# EAGLE design nerd100 (EAGLE 4.16)
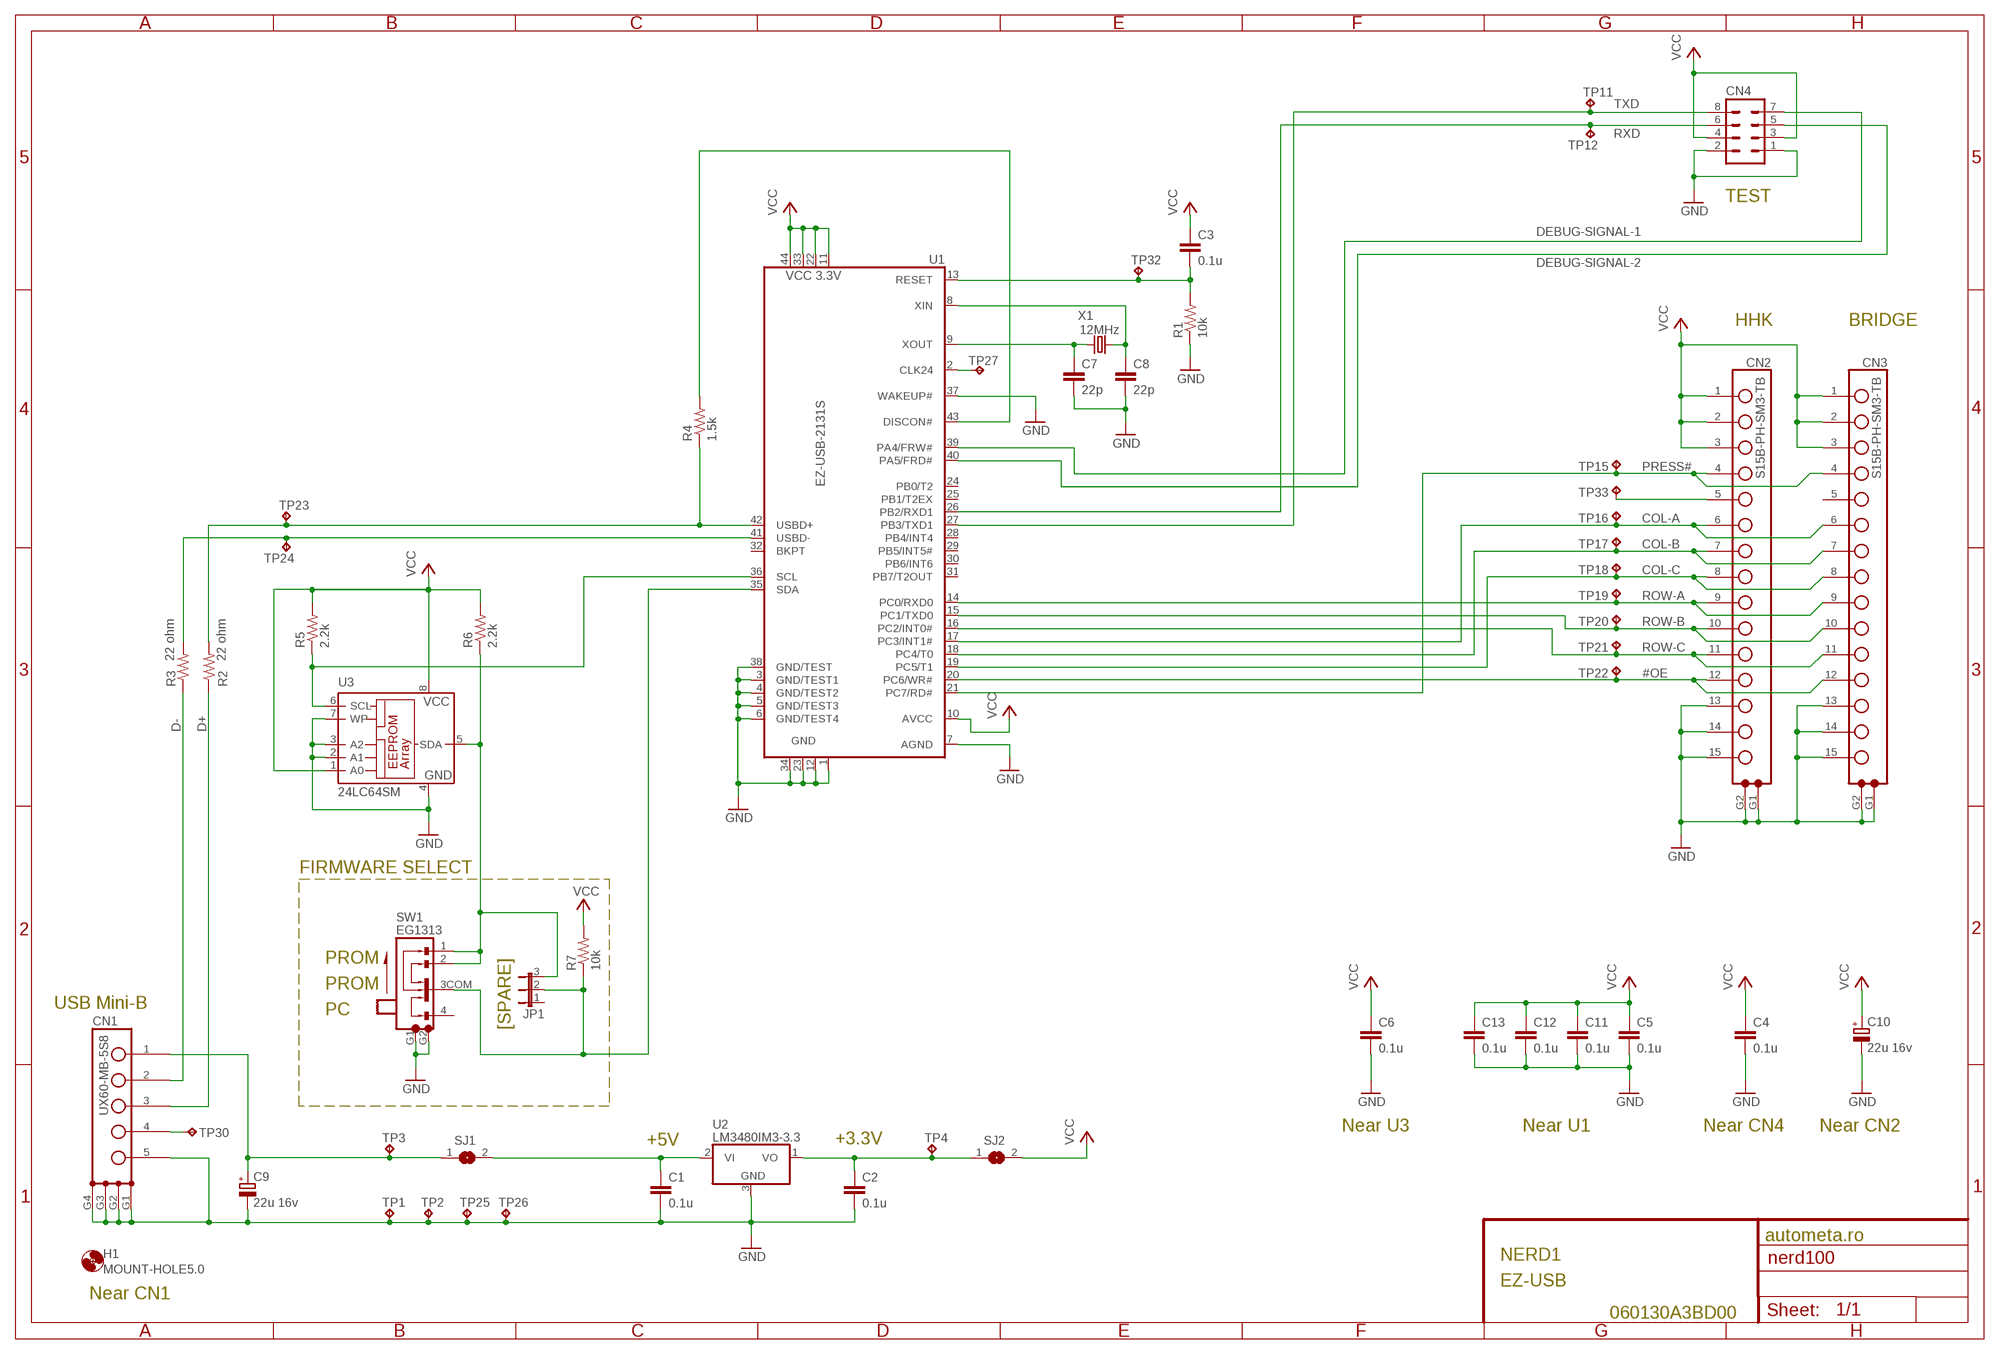
[diagram p0: schematic, sheet 1]

## Parts
C1  0.1u  C-EUC0805  [C0805]
C2  0.1u  C-EUC0805  [C0805]
C3  0.1u  C-EUC0805  [C0805]
C4  0.1u  C-EUC0805  [C0805]
C5  0.1u  C-EUC0805  [C0805]
C6  0.1u  C-EUC0805  [C0805]
C7  22p  C-EUC0805  [C0805]
C8  22p  C-EUC0805  [C0805]
C9  22u 16v  CPOL-EUC  [PANASONIC_C]
C10  22u 16v  CPOL-EUC  [PANASONIC_C]
C11  0.1u  C-EUC0805  [C0805]
C12  0.1u  C-EUC0805  [C0805]
C13  0.1u  C-EUC0805  [C0805]
CN1  UX60-MB-5S8  UX60-MB-5S8UX60-MB-5S8  [UX60-MB-5S8]
CN2  S15B-PH-SM3-TB  S15B-PH-SM-TBS15B-PH-SM3-TB  [S15B-PH-SM*-TB]
CN3  S15B-PH-SM3-TB  S15B-PH-SM-TBS15B-PH-SM3-TB  [S15B-PH-SM*-TB]
CN4  MA04-2  [MA04-2]
H1  MOUNT-HOLE5.0  [5,0]
JP1  JP2E  [JP2]
R1  10k  R-US_R0805  [R0805]
R2  22 ohm  R-US_R0805  [R0805]
R3  22 ohm  R-US_R0805  [R0805]
R4  1.5k  R-US_R0805  [R0805]
R5  2.2k  R-US_R0805  [R0805]
R6  2.2k  R-US_R0805  [R0805]
R7  10k  R-US_R0805  [R0805]
SJ1  SJW  [SJW]
SJ2  SJW  [SJW]
SW1  EG1313  [EG1313]
TP1  TPPAD1-13  [P1-13]
TP2  TPPAD1-13  [P1-13]
TP3  TPPAD1-13  [P1-13]
TP4  TPPAD1-13  [P1-13]
TP11  TPPAD1-13  [P1-13]
TP12  TPPAD1-13  [P1-13]
TP15  TPPAD1-13  [P1-13]
TP16  TPPAD1-13  [P1-13]
TP17  TPPAD1-13  [P1-13]
TP18  TPPAD1-13  [P1-13]
TP19  TPPAD1-13  [P1-13]
TP20  TPPAD1-13  [P1-13]
TP21  TPPAD1-13  [P1-13]
TP22  TPPAD1-13  [P1-13]
TP23  TPPAD1-13  [P1-13]
TP24  TPPAD1-13  [P1-13]
TP25  TPPAD1-13  [P1-13]
TP26  TPPAD1-13  [P1-13]
TP27  TPPAD1-13  [P1-13]
TP30  TPPAD1-13  [P1-13]
TP32  TPPAD1-13  [P1-13]
TP33  TPPAD1-13  [P1-13]
U1  EZ-USB-2131S  [PQFP44]
U2  LM3480IM3-3.3  LM3840  [SOT-23]
U3  24LC64SM  [SO-08M]
X1  12MHz  CRYTALHC49U-V  [HC49U-V]

## Nets
#OE: CN2.12($12) CN3.12($12) TP22.1(TP) U1.20(PC6/WR#)
COL-A: CN2.6($6) CN3.6($6) TP16.1(TP) U1.17(PC3/INT1#)
COL-B: CN2.7($7) CN3.7($7) TP17.1(TP) U1.18(PC4/T0)
COL-C: CN2.8($8) CN3.8($8) TP18.1(TP) U1.19(PC5/T1)
D+: CN1.3(D+) R2.1
D-: CN1.2(D-) R3.1
DEBUG-SIGNAL-1: CN4.7 U1.39(PA4/FRW#)
DEBUG-SIGNAL-2: CN4.5 U1.40(PA5/FRD#)
GND [GND]: C1.2 C2.2 C4.2 C5.2 C6.2 C7.2 C8.2 C9.- C10.- C11.2 C12.2 C13.2 CN1.5(GND) CN1.G1 CN1.G2 CN1.G3 CN1.G4 CN2.13($13) CN2.14($14) CN2.15($15) CN2.G1 CN2.G2 CN3.13($13) CN3.14($14) CN3.15($15) CN3.G1 CN3.G2 CN4.1 CN4.2 R1.1 SW1.G1 SW1.G2 TP1.1(TP) TP2.1(TP) TP25.1(TP) TP26.1(TP) U1.1(GND) U1.3(GND/TEST1) U1.4(GND/TEST2) U1.5(GND/TEST3) U1.6(GND/TEST4) U1.7(AGND) U1.12(GND) U1.23(GND) U1.34(GND) U1.37(WAKEUP#) U1.38(GND/TEST) U2.3(GND) U3.2(A1) U3.3(A2) U3.4(GND) U3.7(WP)
N$1: C7.1 U1.9(XOUT) X1.1
N$2: R3.2 TP24.1(TP) U1.41(USBD-)
N$3: C8.1 U1.8(XIN) X1.2
N$4: C3.2 R1.2 TP32.1(TP) U1.13(RESET)
N$5: R2.2 R4.1 TP23.1(TP) U1.42(USBD+)
N$6 [+V]: C1.1 SJ1.2 U2.2(VI)
N$7: R4.2 U1.43(DISCON#)
N$16 [+V]: C2.1 SJ2.1 TP4.1(TP) U2.1(VO)
N$17: TP27.1(TP) U1.2(CLK24)
N$18: CN1.4(ID) TP30.1(TP)
N$20: JP1.3 R6.1 SW1.1 SW1.2 U3.5(SDA)
N$26: CN2.5($5) TP33.1(TP)
PRESS#: CN2.4($4) CN3.4($4) TP15.1(TP) U1.21(PC7/RD#)
ROW-A: CN2.9($9) CN3.9($9) TP19.1(TP) U1.14(PC0/RXD0)
ROW-B: CN2.10($10) CN3.10($10) TP20.1(TP) U1.15(PC1/TXD0)
ROW-C: CN2.11($11) CN3.11($11) TP21.1(TP) U1.16(PC2/INT0#)
RXD: CN4.6 TP12.1(TP) U1.26(PB2/RXD1)
SCL: R5.1 U1.36(SCL) U3.6(SCL)
SDA: JP1.2 R7.1 SW1.3COM U1.35(SDA)
TXD: CN4.8 TP11.1(TP) U1.27(PB3/TXD1)
VBUS [+V]: C9.+ CN1.1(VBUS) SJ1.1 TP3.1(TP)
VCC [+V]: C3.1 C4.1 C5.1 C6.1 C10.+ C11.1 C12.1 C13.1 CN2.1($1) CN2.2($2) CN2.3($3) CN3.1($1) CN3.2($2) CN3.3($3) CN4.3 CN4.4 R5.2 R6.2 R7.2 SJ2.2 U1.10(AVCC) U1.11(VCC3.3) U1.22(VCC3.3) U1.33(VCC3.3) U1.44(VCC3.3) U3.1(A0) U3.8(VCC)
Unconnected: CN3.5($5) JP1.1 SW1.4 U1.24(PB0/T2) U1.25(PB1/T2EX) U1.28(PB4/INT4) U1.29(PB5/INT5#) U1.30(PB6/INT6) U1.31(PB7/T2OUT) U1.32(BKPT)

## Notes on the sheet
- TEST
- HHK | BRIDGE
- FIRMWARE SELECT
- PROM
- PROM
- USB Mini-B
- PC
- [SPARE]
- Near U3 | Near U1 | Near CN4 | Near CN2
- +5V | +3.3V
- autometa.ro
- NERD1
- Near CN1 | EZ-USB
- 060130A3BD00

## Library data of the parts
C1-C8 C11-C13 = rcl:C-EU: CAPACITOR, European symbol
C9 C10 = rcl:CPOL-EU: POLARIZED CAPACITOR, European symbol
CN1 = nerd100:UX60-MB-5S8: USB mini-B receptor
CN2 CN3 = nerd100:S15B-PH-SM*-TB: connecter header vender: JST pin pitch: 2.0mm pins: 15 angle: right angle mount: SMD
CN4 = con-lstb:MA04-2: PIN HEADER
H1 = holes:MOUNT-HOLE: MOUNTING HOLE with drill center marker
JP1 = jumper:JP2E: JUMPER
R1-R7 = rcl:R-US_: RESISTOR, American symbol
SJ1 SJ2 = jumper:SJ: SMD solder JUMPER
SW1 = nerd100:EG1313: EG1313: SLIDE SWITCH VENDOR: E-SWITCH PIN: 4 LEAD: THROUGH HOLE CIRCUIT: 1 CONTACT: 3 + 1COMMON
TP1-TP4 TP11 TP12 TP15-TP27 TP30 TP32 TP33 = testpad:TP
U1 = cypress:EZ-USB-2*S: Microcontroller with USB port
U2 = nerd100:LM3840: 3 terminal regurator
U3 = microchip:24*: Serial EEPROM I2C
X1 = crystal:CRYTAL: CRYSTAL

## Net classes
1 GND: width 0.254 mm, drill 0.254 mm
2 +V: width 0.254 mm, drill 0.254 mm

## Board
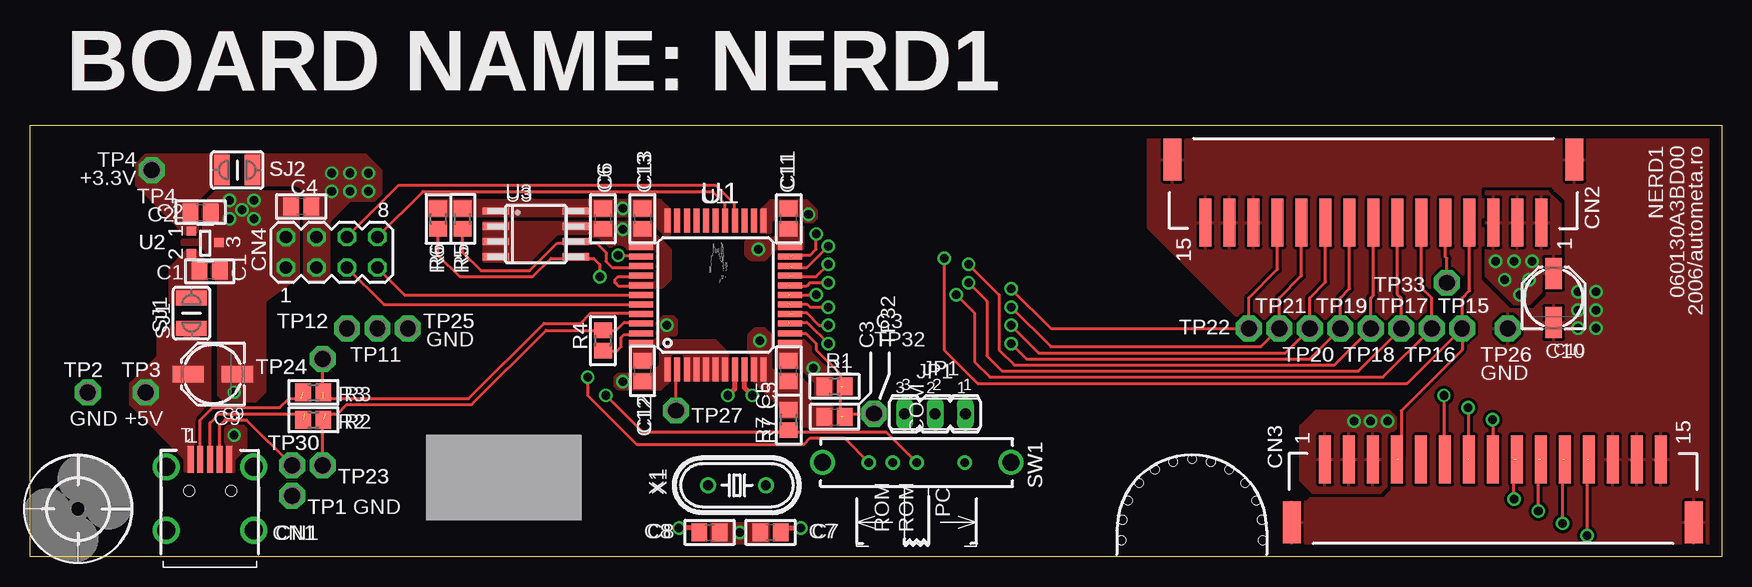
[diagram p1: board, top side]
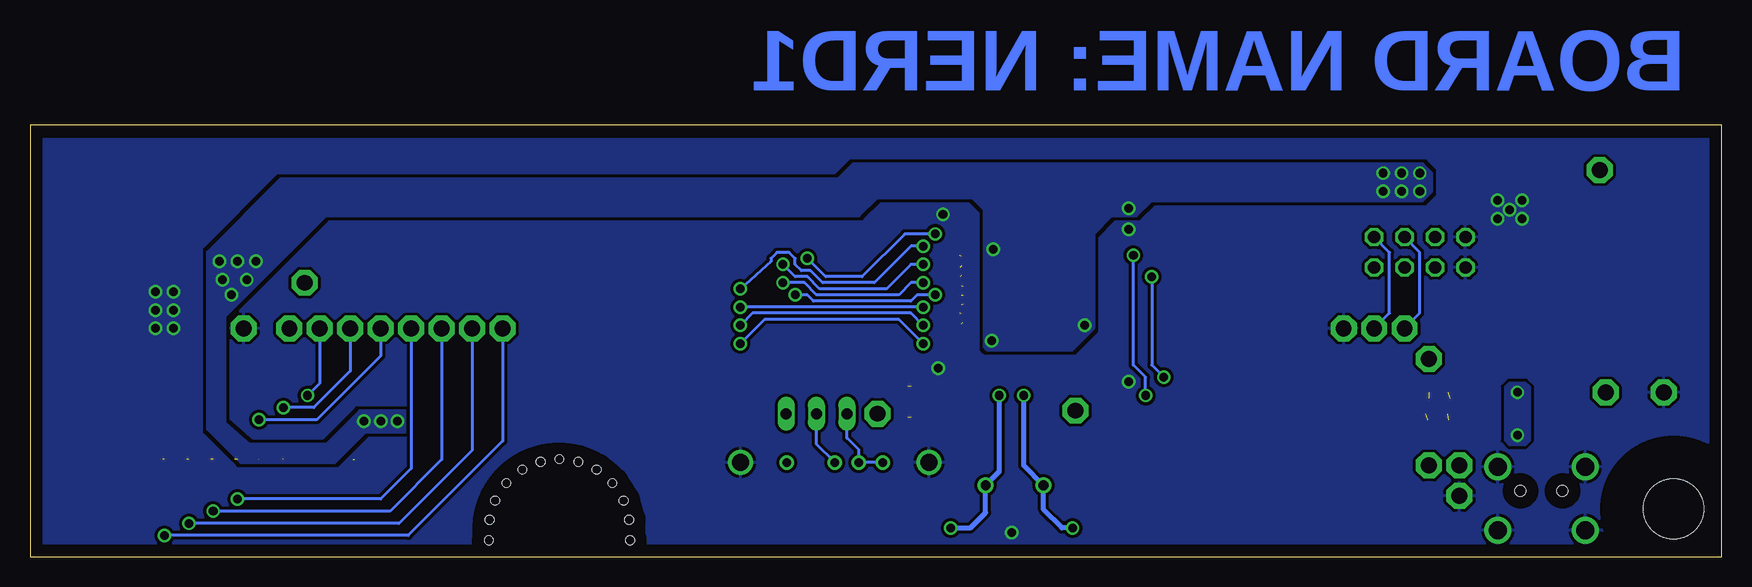
[diagram p2: board, bottom side, seen from below]

Size 141 x 36 mm. Coordinates in mm from the lower left corner, seen from the top.
Outline: 0,0 0,36 141,36 141,0 0,0
Copper layers (1*16): Top 0.035mm / dielectric 1.5mm / Bottom 0.035mm
Design rules "olimex_10mils": minimum track width 10mil, minimum drill 24mil, track to track 10mil, track to pad 10mil, pad to pad 10mil, via to via 10mil, smd to smd 10mil, copper to edge 40mil, drill to drill 10mil, minimum pad ring 10mil, minimum via ring 8mil, stop-mask expansion 0mil, vias tented up to drill 0mil, thermal gap 10mil
Holes 0.71 mm at 91.05,3.09 95.29,7.92 93.78,7.26 92.45,6.14 91.52,4.69 90.98,1.37 102.69,3.09 98.45,7.92 99.96,7.26 101.29,6.14 102.22,4.69 102.76,1.37 96.87,8.14
tRestrict: area 89.7,-4.9 to 104.1,9.5
bRestrict: area 89.7,-4.9 to 104.1,9.5; 8 lines

### Footprints (pad centres in the part's own frame; a part is rotated, then mirrored left to right if it is on the bottom)
C0805 = smd 1.3 x 1.5: 1 -0.85,0; 2 0.85,0
PANASONIC_C = smd 2.6 x 1.4: + 2.05,0; - -2.05,0
UX60-MB-5S8 = smd 2.25 x 0.5: 1 -2.629,-1.6; 2 -2.629,-0.8; 3 -2.629,0; 4 -2.629,0.8; 5 -2.629,1.6 | drill 1.5 round: G1 -2,3.65; G2 3.3,3.65; G3 -2,-3.65; G4 3.3,-3.65 | hole 0.9: 0,1.75; 0,-1.75
S15B-PH-SM*-TB = smd 4 x 1: 1 0,0; 2 0,-2; 3 0,-4; 4 0,-6; 5 0,-8; 6 0,-10; 7 0,-12; 8 0,-14; 9 0,-16; 10 0,-18; 11 0,-20; 12 0,-22; 13 0,-24; 14 0,-26; 15 0,-28 | smd 3.5 x 1.5: G1 -5.25,2.751; G2 -5.25,-30.75
MA04-2 = drill 1.016 octagon: 1 -3.81,-1.27; 2 -3.81,1.27; 3 -1.27,-1.27; 4 -1.27,1.27; 5 1.27,-1.27; 6 1.27,1.27; 7 3.81,-1.27; 8 3.81,1.27
5,0 = hole 5: 0,0
JP2 = drill 0.914 long: 1 -2.54,0; 2 0,0; 3 2.54,0
R0805 = smd 1.3 x 1.5: 1 -0.85,0; 2 0.85,0
SJW = smd 1.27 x 2.54: 1 -1.27,0; 2 1.27,0
EG1313 = drill 0.7 round: 1 -4,0; 2 -2,0; 3COM 0,0; 4 4,0 | drill 1.4 round: G1 -7.85,0; G2 7.85,0
P1-13 = drill 1.321 pad 2.159 octagon: 1 0,0
PQFP44 = smd 2 x 0.5: 1 -6.2,4; 2 -6.2,3.2; 3 -6.2,2.4; 4 -6.2,1.6; 5 -6.2,0.8; 6 -6.2,0; 7 -6.2,-0.8; 8 -6.2,-1.6; 9 -6.2,-2.4; 10 -6.2,-3.2; 11 -6.2,-4; 23 6.2,-4; 24 6.2,-3.2; 25 6.2,-2.4; 26 6.2,-1.6; 27 6.2,-0.8; 28 6.2,0; 29 6.2,0.8; 30 6.2,1.6; 31 6.2,2.4; 32 6.2,3.2; 33 6.2,4 | smd 0.5 x 2: 12 -4,-6.2; 13 -3.2,-6.2; 14 -2.4,-6.2; 15 -1.6,-6.2; 16 -0.8,-6.2; 17 0,-6.2; 18 0.8,-6.2; 19 1.6,-6.2; 20 2.4,-6.2; 21 3.2,-6.2; 22 4,-6.2; 34 4,6.2; 35 3.2,6.2; 36 2.4,6.2; 37 1.6,6.2; 38 0.8,6.2; 39 0,6.2; 40 -0.8,6.2; 41 -1.6,6.2; 42 -2.4,6.2; 43 -3.2,6.2; 44 -4,6.2
SOT-23 = smd 0.76 x 0.76: 1 0,0; 2 0,-1.9; 3 2.29,-0.95
SO-08M = smd 0.6 x 2.2: 1 -1.905,-3.33; 2 -0.635,-3.33; 3 0.635,-3.33; 4 1.905,-3.33; 5 1.905,3.33; 6 0.635,3.33; 7 -0.635,3.33; 8 -1.905,3.33
HC49U-V = drill 0.813 round: 1 -2.413,0; 2 2.413,0

### Placement (x,y rotation side)
C1  14.99,23.88 0 top
C2  14.22,28.7 0 top
C3  67.06,11.68 0 top
C4  22.61,29.21 180 top
C5  63.25,15.49 90 top
C6  47.75,28.19 270 top
C7  61.72,2.03 180 top
C8  56.64,2.03 0 top
C9  15.24,15.24 180 top
C10  127,21.59 90 top
C11  63.25,28.19 90 top
C12  51.05,15.49 270 top
C13  51.05,28.19 270 top
CN1  15,5.51 270 top
CN2  126,27.9 270 top
CN3  107.95,8.13 90 top
CN4  25.15,25.4 0 top
H1  4,4 0 top
JP1  75.44,11.94 180 top
R1  67.06,14.22 0 top
R2  23.62,11.43 0 top
R3  23.62,13.72 0 top
R4  47.75,18.03 270 top
R5  36.07,28.19 90 top
R6  34.04,28.19 90 top
R7  63.25,11.43 90 top
SJ1  13.46,20.32 90 top
SJ2  17.27,32.26 0 top
SW1  73.91,7.87 0 top
TP1  21.84,5.08 0 top
TP2  4.83,13.72 0 top
TP3  9.65,13.72 0 top
TP4  10.16,32.26 0 top
TP11  28.96,19.05 0 top
TP12  26.42,19.05 0 top
TP15  119.38,19.05 0 top
TP16  116.84,19.05 0 top
TP17  114.3,19.05 0 top
TP18  111.76,19.05 0 top
TP19  109.22,19.05 0 top
TP20  106.68,19.05 0 top
TP21  104.14,19.05 0 top
TP22  101.6,19.05 0 top
TP23  24.38,7.62 0 top
TP24  24.38,16.51 0 top
TP25  31.5,19.05 0 top
TP26  123.19,19.05 0 top
TP27  53.85,12.19 0 top
TP30  21.84,7.62 0 top
TP32  70.36,11.94 0 top
TP33  118.11,22.86 0 top
U1  57.15,21.84 90 top
U2  13.46,27.18 0 top
U3  42.16,26.92 270 top
X1  58.93,5.97 180 top

### Tracks (layer width: path | path; a pad name or v marks a point on that pad's centre or on a via)
#OE  (via drill 0.71)  (2 unrouted)
  Top 0.254: CN2.12 104,23.99 101.6,21.59 TP22.1 85.09,19.05 v81.79,22.35 | v129.79,1.78 129.79,8.13 | v66.55,25.91 64.77,24.13 63.5,24.13
  Bottom 0.254: v129.79,1.78 109.47,1.78 101.6,9.65 TP22.1 | v66.55,25.91 67.56,25.91 70.61,22.86 74.93,22.86 75.95,23.88 76.71,23.88 77.22,24.38 77.22,24.89 77.72,25.4 78.74,25.4 79.25,24.89 79.25,24.64 v81.79,22.35
COL-A  (via drill 0.71)  (1 unrouted)
  Top 0.254: CN2.6 116,22.43 116.84,21.59 TP16.1 112.78,14.99 80.01,14.99 78.74,16.26 78.74,20.32 v77.22,21.84 | CN3.6 117.86,8.13 v117.86,13.46 | 63.25,21.84 v65.53,21.84
  Bottom 0.254: v117.86,13.46 116.84,14.48 TP16.1 | v65.53,21.84 67.06,21.84 67.56,21.34 75.69,21.34 76.2,21.84 v77.22,21.84
COL-B  (via drill 0.71)  (2 unrouted)
  Top 0.254: CN2.7 114,21.89 114.3,21.59 TP17.1 110.74,15.49 81.03,15.49 79.76,16.76 79.76,21.34 v78.23,22.86 | v119.89,12.45 119.89,8.13 | v66.55,22.86 65.02,22.86 64.77,22.61 63.25,22.61
  Bottom 0.254: v119.89,12.45 117.35,12.45 114.3,15.49 TP17.1 | v66.55,22.86 67.56,22.86 68.58,21.84 75.44,21.84 76.45,22.86 v78.23,22.86
COL-C  (via drill 0.71)  (2 unrouted)
  Top 0.254: CN2.8 112,21.83 111.76,21.59 TP18.1 108.71,16 82.04,16 80.77,17.27 80.77,21.84 v78.23,24.38 | v121.92,11.43 121.92,8.13 | v66.55,24.38 65.53,23.37 63.5,23.37
  Bottom 0.254: v121.92,11.43 117.09,11.43 111.76,16.76 TP18.1 | v66.55,24.38 67.56,24.38 69.6,22.35 75.18,22.35 76.2,23.37 77.22,23.37 v78.23,24.38
D+  (1 unrouted)
  Top 0.254: CN1.3 15,11.19 15.75,11.94 22.86,11.94
D-  (1 unrouted)
  Top 0.254: CN1.2 14.2,11.41 15.24,12.45 20.83,12.45 21.59,13.21 22.61,13.21
DEBUG-SIGNAL-1
  Top 0.254: U1.39 31.24,21.84 CN4.7
DEBUG-SIGNAL-2
  Top 0.254: U1.40 29.5,21.04 CN4.5
GND  (via drill 0.71)
  Top 0.254: U1.38 50.84,22.64 50.8,22.61 49.02,22.61 48.77,22.86 48.77,23.11 49.02,23.37 50.8,23.37 50.88,23.44 U1.37
  other vias: 59.18,2.03 64.9,28.57 65.28,15.75 49.4,14.61 49.4,27.3 17.02,10.16 17.02,13.72 16.64,29.72 17.65,28.96 18.67,29.72 18.67,28.19 16.64,28.19 130.56,20.57 129.03,20.57 129.03,19.05 130.56,19.05 130.56,22.1 129.03,22.1
  pour Bottom (rank 6): 1.02,35 139.95,35 139.95,1.02 1.02,1.02
  pour Top (rank 6): 101.6,19.05 93.22,27.43 93.22,34.8 140.21,34.8 140.21,0.76 104.65,0.76 104.65,4.57 106.43,4.57 106.93,5.08 112.52,5.08 112.52,11.18 120.14,19.05
  pour Top (no thermals): 56.77,2.79 61.59,2.79 61.59,1.02 56.77,1.02
  pour Top (no thermals): 53.59,18.03 57.15,18.03 58.17,17.02 58.17,14.73 54.61,14.73 54.61,16.76 53.34,16.76 53.34,14.73 52.58,13.97 49.02,13.97 48.77,14.22 48.77,14.99 49.02,15.24 51.82,15.24 52.58,16 52.58,17.02
  pour Top (no thermals): 61.72,29.72 64.77,29.72 65.53,28.96 65.53,28.19 65.28,27.94 64.64,27.94 64.14,28.45 62.23,28.45 61.72,27.94 61.72,27.05 60.96,27.05 60.96,28.96
  pour Top (no thermals): 62.48,18.03 64.77,18.03 66.8,16 66.8,13.46 65.53,13.46 65.53,14.48 64.26,15.75 62.48,15.75
  pour Top (no thermals): 37.85,27.94 51.82,27.94 51.82,27.18 53.34,25.65 53.34,23.11 52.7,22.48 50.04,22.48 50.04,22.86 52.07,22.86 52.32,23.11 52.32,25.4 52.07,25.65 48.51,25.65 47.5,26.67 46.99,26.67 46.74,26.92 43.94,26.92 41.66,24.64 37.85,24.64
  pour Top (no thermals): 16.26,7.11 17.02,7.11 17.02,8.13 18.03,9.14 18.03,10.67 17.78,10.92 16.51,10.92 16.26,10.67
  pour Top (no thermals): 14.48,26.92 14.48,29.46 15.49,30.48 22.1,30.48 22.35,30.23 22.35,23.37 19.56,21.34 19.56,13.72 18.8,12.95 16.26,12.95 15.75,13.46 15.75,22.86 15.24,23.37 15.24,24.89 14.1,26.04 12.7,26.04 12.7,26.42 13.97,26.42
N$1  (via drill 0.71)
  Top 0.406: U1.9 59.55,14.11 v60.2,13.46 | C7.1 62.48,2.03 62.87,2.41 v64.26,2.41
  Bottom 0.406: v64.26,2.41 62.61,2.41 61.34,3.68 X1.1 60.2,7.11 v60.2,13.46
N$2  (1 unrouted)
  Top 0.254: R3.2 24.38,13.72 TP24.1 | 24.38,13.21 36.58,13.21 42.85,19.48 45.9,19.48 46.74,20.32 50.8,20.32 50.88,20.24 U1.41
N$3  (via drill 0.71)
  Top 0.406: U1.8 58.75,14.05 v58.17,13.46 | C8.1 55.88,2.03 55.5,2.41 v54.1,2.41
  Bottom 0.406: v54.1,2.41 54.99,2.41 56.52,3.94 X1.2 58.17,7.62 v58.17,13.46
N$4  (2 unrouted)
  Top 0.254: U1.13 64.67,18.64 65.53,17.78 65.53,17.27 67.56,15.24 67.56,14.48 67.82,14.22 arc180 R1.2 68.33,14.22 | 67.56,11.68 67.56,14.22 | C3.2 67.82,11.68 68.07,11.94 TP32.1
N$5  (1 unrouted)
  Top 0.254: U1.42 50.95,19.45 51.05,19.56 49.53,19.56 48.86,18.88 R4.1 43.01,18.88 36.83,12.7 26.42,12.7 25.65,11.94 24.64,11.94 | R2.2 24.38,11.43 TP23.1
N$6
  pour Top (rank 6, no thermals): 13.08,25.53 14.73,25.53 14.73,21.08 11.94,21.08 11.68,21.34 11.68,24.13
N$7
  Top 0.254: R4.2 48.93,17.18 49.28,17.53 49.28,18.29 49.53,18.54 50.8,18.54 50.9,18.64 U1.43
N$16
  pour Top (rank 6, no thermals): 9.65,33.53 16.51,33.53 16.51,30.99 15.24,30.99 13.97,29.72 13.97,26.92 12.95,26.92 8.89,30.99 8.89,32.77
N$17
  Top 0.254: U1.2 53.95,15.6 53.85,15.49 TP27.1
N$18
  Top 0.254: CN1.4 15.8,10.97 16.26,11.43 18.03,11.43 TP30.1
N$20  (via drill 0.71)
  Top 0.254: SW1.1 67.88,9.91 65.02,9.91 64.52,9.4 50.55,9.4 46.48,13.46 v46.48,14.99 | R6.1 34.04,25.15 35.81,23.37 41.91,23.37 43.43,24.89 45.47,24.89 | 45.47,24.89 45.49,24.92 U3.5 | 45.47,24.89 46.99,24.89 47.5,24.38 v47.5,23.37
  Bottom 0.254: SW1.1 SW1.2 71.91,8.92 72.9,9.91 JP1.3 | v47.5,23.37 47.5,16 v46.48,14.99
N$26
  Top 0.254: CN2.5 118,25 118.11,24.89 TP33.1
PRESS#  (via drill 0.71)  (2 unrouted)
  Top 0.254: CN2.4 120,22.21 119.38,21.59 TP15.1 | 114.05,8.13 114.3,8.38 114.3,12.19 119.38,17.27 TP15.1 | TP15.1 114.81,14.48 78.99,14.48 76.2,17.27 v76.2,24.89 | v65.53,26.92 65.53,25.65 65.02,25.15 63.5,25.15
  Bottom 0.254: v65.53,26.92 68.07,26.92 71.63,23.37 74.68,23.37 v76.2,24.89
ROW-A  (via drill 0.71)  (2 unrouted)
  Top 0.254: CN2.9 110,22.37 109.22,21.59 TP19.1 106.68,16.51 83.06,16.51 v81.79,17.78 | v123.7,4.83 123.7,8.13 | v66.55,17.78 64.77,19.56 63.25,19.56
  Bottom 0.254: v123.7,4.83 111.76,4.83 109.22,7.37 TP19.1 | v66.55,17.78 68.58,19.81 79.76,19.81 v81.79,17.78
ROW-B  (via drill 0.71)  (2 unrouted)
  Top 0.254: CN2.10 108,22.91 106.68,21.59 TP20.1 104.65,17.02 84.07,17.02 v81.79,19.3 | v125.73,3.81 125.73,8.13 | v66.55,19.3 65.79,19.3 64.77,20.32 63.5,20.32
  Bottom 0.254: v125.73,3.81 111,3.81 106.68,8.13 TP20.1 | v66.55,19.3 67.56,20.32 80.77,20.32 v81.79,19.3
ROW-C  (via drill 0.71)  (2 unrouted)
  Top 0.254: CN2.11 106,23.45 104.14,21.59 TP21.1 102.62,17.53 85.09,17.53 v81.79,20.83 | v127.76,2.79 127.76,8.13 | 63.25,21.08 64.77,21.08 65.02,20.83 v66.55,20.83
  Bottom 0.254: v127.76,2.79 110.24,2.79 104.14,8.89 TP21.1 | v66.55,20.83 v81.79,20.83
RXD
  Top 0.254: CN4.6 30.73,30.99 57.15,30.99 58.67,29.46 58.67,27.94 58.75,28.02 U1.26
  Bottom 0.254: CN4.6 25.15,25.4 25.15,20.32 TP12.1
SCL
  Top 0.254: R5.1 36.07,25.4 37.59,23.88 41.66,23.88 43.94,26.16 45.47,26.16 45.49,26.19 | 45.49,26.19 U3.6 | 45.49,26.19 46.96,26.19 47.22,26.19 48.01,25.4 48.01,24.64 48.51,24.13 50.8,24.13 50.91,24.24 U1.36
SDA  (via drill 0.71)
  Top 0.254: SW1.3COM 71.37,10.41 63.25,10.41 R7.1 63.08,10.41 51.05,10.41 v48.01,13.46 | 51.05,25.15 | 51.05,25.15 U1.35 | v49.02,25.15 51.05,25.15
  Bottom 0.254: SW1.3COM 75.44,9.4 JP1.2 | v49.02,25.15 49.02,16 48.01,14.99 v48.01,13.46
TXD
  Top 0.254: CN4.8 32.77,30.48 56.9,30.48 57.91,29.46 57.91,28.19 57.95,28.16 U1.27
  Bottom 0.254: CN4.8 27.69,25.4 27.69,20.32 TP11.1
VBUS
  pour Top (no thermals): 11.94,19.3 11.94,19.05 12.45,19.05 12.45,18.54 11.94,18.54 11.94,18.03 12.95,18.03 12.95,18.54 13.97,18.54 13.97,18.03 14.99,18.03 14.99,12.95 13.72,11.68 13.72,7.11 12.95,7.11 12.95,8.13 8.38,12.7 8.38,14.48 10.67,16.76 10.67,18.29
VCC  (via drill 0.71)
  other vias: 110.36,11.3 111.76,11.3 113.16,11.3 122.17,24.64 123.7,24.64 122.94,23.11 125.22,24.64 124.21,21.84 124.97,23.11 60.83,18.03 60.71,25.65 53.09,19.3 49.4,29.08 25.15,32 26.67,32 28.19,32 25.15,30.48 26.67,30.48 28.19,30.48
  pour Top: 121.41,30.48 126.49,30.48 127.51,29.46 127.51,22.61 126.49,22.61 124.97,21.08 123.7,21.08 121.41,23.37
  pour Top: 105.92,10.92 107.19,12.19 113.28,12.19 113.79,11.68 113.79,10.67 113.03,9.91 113.03,5.84 112.52,5.33 106.93,5.33 105.92,6.35
  pour Bottom: 109.73,12.19 113.54,12.19 116.33,9.4 122.68,9.4 124.71,11.18 124.71,20.07 116.33,28.45 71.88,28.45 70.36,29.97 62.48,29.97 61.47,28.96 61.47,17.53 61.21,17.27 54.1,17.27 52.32,19.05 52.32,26.92 50.8,28.45 48.77,28.45 47.5,29.72 24.89,29.72 24.13,30.48 24.13,32 24.89,32.77 72.39,32.77 73.66,31.5 120.14,31.5 126.24,25.4 126.24,10.67 123.44,7.87 115.57,7.87 113.03,10.41 109.73,10.41
  pour Top (rank 6, no thermals): 61.21,19.05 61.72,18.54 61.72,15.75 61.98,15.49 65.02,15.49 65.02,12.95 65.28,12.7 66.8,12.7 66.8,10.79 62.61,10.79 62.61,12.45 60.33,14.73 59.94,14.73 59.94,18.54 60.45,19.05
  pour Top (rank 6, no thermals): 62.48,27.94 64.01,27.94 64.39,27.56 64.39,25.65 62.1,25.65 61.21,24.77 60.07,24.77 59.69,25.15 59.69,26.29 59.94,26.54 61.85,26.54 62.23,26.92 62.23,27.69
  pour Top (rank 6, no thermals): 50.04,18.03 51.82,18.03 52.32,18.54 52.32,19.56 52.83,20.07 53.59,20.07 53.85,19.81 53.85,18.54 52.07,16.76 52.07,16 51.82,15.75 50.04,15.75
  pour Top (rank 6, no thermals): 33.02,28.45 52.07,28.45 52.07,26.92 53.34,26.92 53.34,28.96 52.58,29.72 33.27,29.72 33.02,29.46
  pour Top (rank 6, no thermals): 18.03,33.53 27.94,33.53 29.21,32.26 29.21,30.23 28.7,29.72 26.67,29.72 24.89,27.94 24.89,23.37 24.38,22.86 23.37,22.86 22.86,23.37 22.86,30.35 22.23,30.99 18.03,30.99

### Text on the board
Top: BOARD NAME: NERD1 | COMPONENT SIDE
Bottom: BOARD NAME: NERD1 | SOLDER SIDE
tStop: BOARD NAME: NERD1 | SOLDER MASK (COMPONENT SIDE)
bStop: BOARD NAME: NERD1 | SOLDER MASK (SOLDER SIDE)
Reference: 141mm | NO MOUNT | 36mm | 4mm | R6.5mm U-NOTCH | 4mm | FIRMWARE SELECT | D5mm | 97mm
_tsilk: BOARD NAME: NERD1 | TP4 | NERD1 | 060130A3BD00 | 2006/autometa.ro | +3.3V | SJ2 | C4 | C6 | C13 | C11 | CN2 | U3 | U1 | C2 | 8 | U2 | 1 | CN4 | 15 | 1 | 3 | 2 | C1 | R6 | R5 | TP33 | 1 | R4 | TP21 | TP19 | TP17 | TP15 | SJ1 | TP12 | TP25 | TP22 | GND | TP32 | C10 | C3 | TP11 | R1 | JP1 | TP20 | TP18 | TP16 | TP26 | TP2 | TP3 | TP24 | 3 | 2 | 1 | GND | R3 | C12 | C9 | C5 | GND | +5V | 1 | R2 | TP27 | SW1 | TP30 | R7 | 1 | 15 | X1 | CN3 | TP23 | TP1 | GND | PC | C8 | C7 | ROM | ROM | CN1 | SILK SCREEN (COMPONENT SIDE)